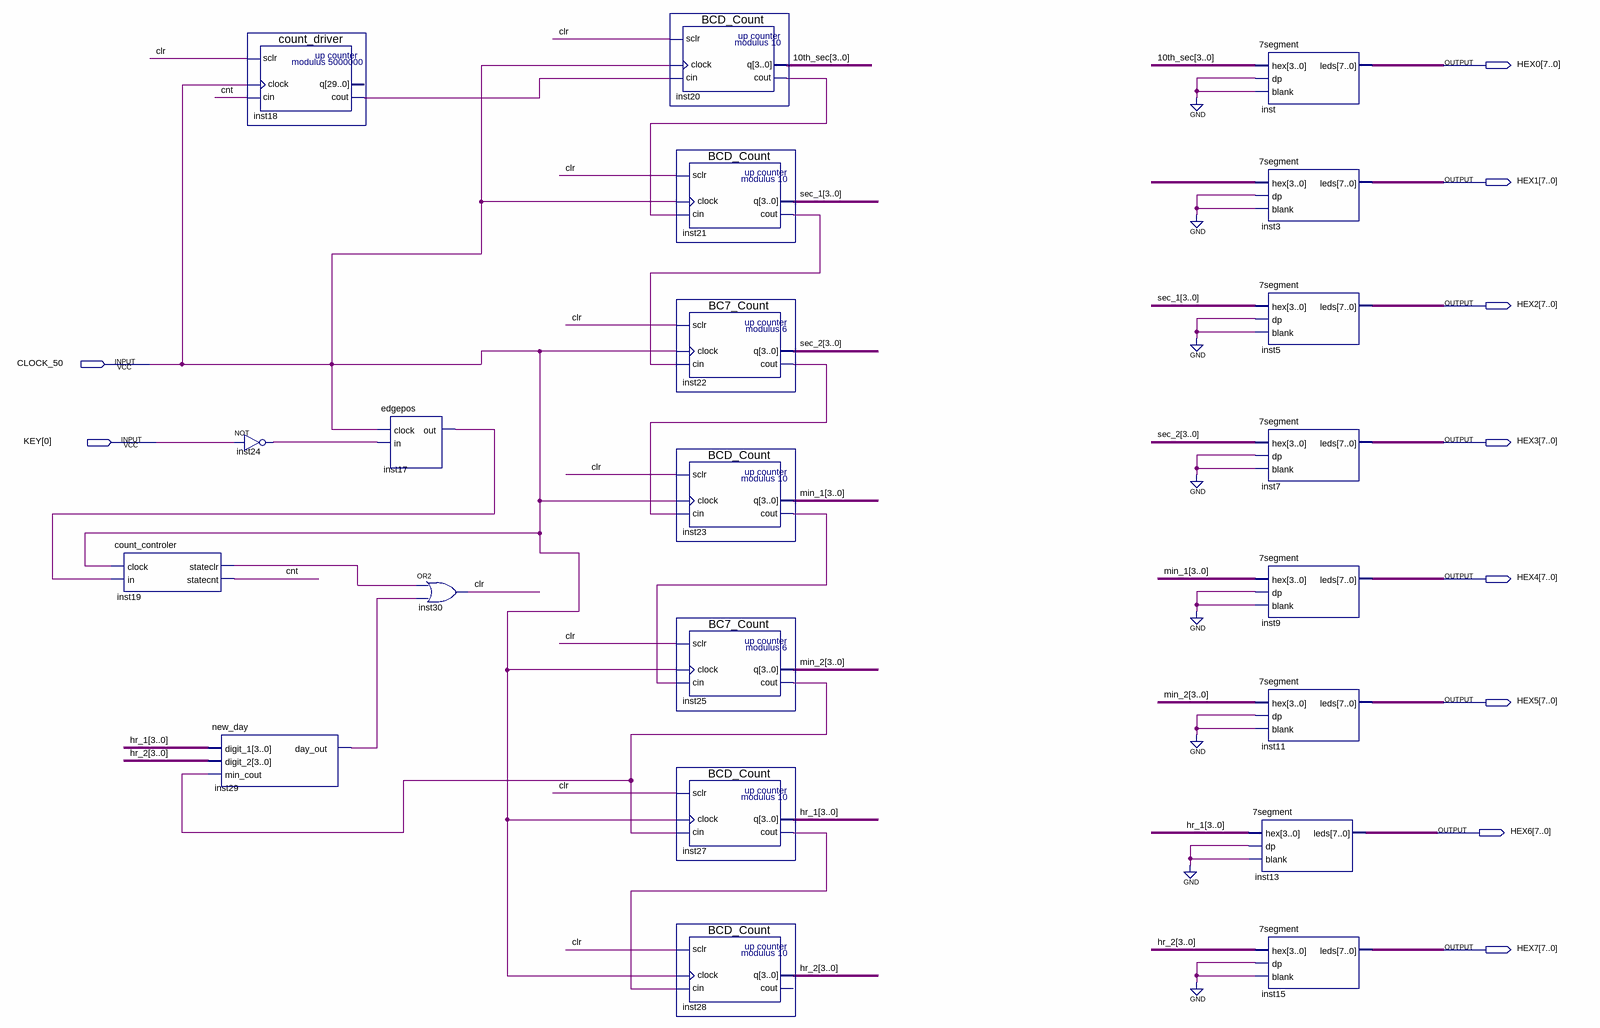
[diagram p0: schematic sheet]
// Quartus schematic TopLevel.bdf as structural Verilog: 21 symbols, 10 pins
module TopLevel (
  input  CLOCK_50,
  input  [0:0] KEY,
  output [7:0] HEX0,
  output [7:0] HEX1,
  output [7:0] HEX2,
  output [7:0] HEX3,
  output [7:0] HEX4,
  output [7:0] HEX5,
  output [7:0] HEX6,
  output [7:0] HEX7
);

  wire clr, cnt, inst17_out, inst18_cout, inst19_stateclr, inst20_cout, inst21_cout, inst22_cout,
       inst23_cout, inst24_out, inst25_cout, inst27_cout, inst29_day_out;
  wire [3:0] \10th_sec , hr_1, hr_2, min_1, min_2, sec_1, sec_2, undriven;

  count_controler inst19 (.clock(CLOCK_50), .in(inst17_out), .stateclr(inst19_stateclr), .statecnt(cnt));
  new_day inst29 (.digit_1(hr_1), .digit_2(hr_2), .min_cout(inst25_cout), .day_out(inst29_day_out));
  count_driver inst18 (.sclr(clr), .clock(CLOCK_50), .cin(cnt), .cout(inst18_cout));  // open: q
  not inst24 (inst24_out, KEY[0]);
  edgepos inst17 (.clock(CLOCK_50), .in(inst24_out), .out(inst17_out));
  or inst30 (clr, inst19_stateclr, inst29_day_out);
  BCD_Count inst20 (.sclr(clr), .clock(CLOCK_50), .cin(inst18_cout), .cout(inst20_cout), .q(\10th_sec ));
  BCD_Count inst21 (.sclr(clr), .clock(CLOCK_50), .cin(inst20_cout), .cout(inst21_cout), .q(sec_1));
  BC7_Count inst22 (.sclr(clr), .clock(CLOCK_50), .cin(inst21_cout), .cout(inst22_cout), .q(sec_2));
  BCD_Count inst23 (.sclr(clr), .clock(CLOCK_50), .cin(inst22_cout), .cout(inst23_cout), .q(min_1));
  BC7_Count inst25 (.sclr(clr), .clock(CLOCK_50), .cin(inst23_cout), .cout(inst25_cout), .q(min_2));
  BCD_Count inst27 (.sclr(clr), .clock(CLOCK_50), .cin(inst25_cout), .cout(inst27_cout), .q(hr_1));
  BCD_Count inst28 (.sclr(clr), .clock(CLOCK_50), .cin(inst27_cout), .q(hr_2));  // open: cout
  \7segment  inst (.hex(\10th_sec ), .dp(1'b0), .blank(1'b0), .leds(HEX0));
  \7segment  inst3 (.hex(undriven), .dp(1'b0), .blank(1'b0), .leds(HEX1));
  \7segment  inst5 (.hex(sec_1), .dp(1'b0), .blank(1'b0), .leds(HEX2));
  \7segment  inst7 (.hex(sec_2), .dp(1'b0), .blank(1'b0), .leds(HEX3));
  \7segment  inst9 (.hex(min_1), .dp(1'b0), .blank(1'b0), .leds(HEX4));
  \7segment  inst11 (.hex(min_2), .dp(1'b0), .blank(1'b0), .leds(HEX5));
  \7segment  inst13 (.hex(hr_1), .dp(1'b0), .blank(1'b0), .leds(HEX6));
  \7segment  inst15 (.hex(hr_2), .dp(1'b0), .blank(1'b0), .leds(HEX7));
endmodule
